# Altium schematic sheet Sheet2.SchDoc
size A4; SheetNumber: 1; SheetTotal: 1
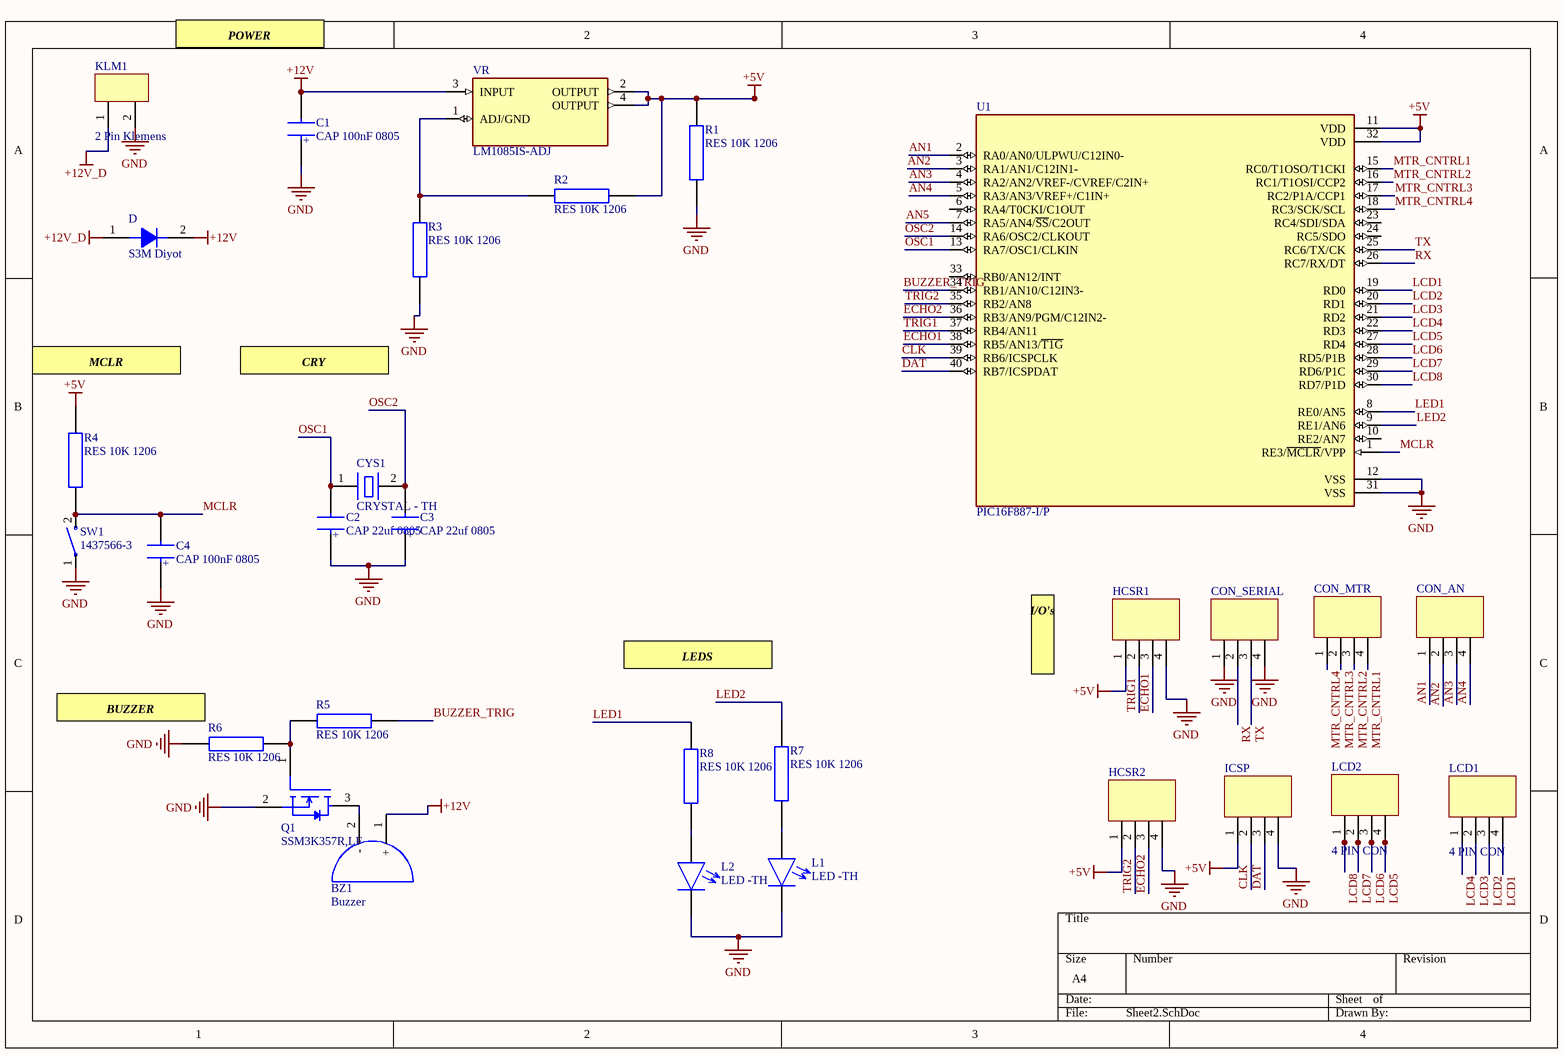
[diagram p0: Sheet2.SchDoc]

## Parts
BZ1  Buzzer  [CMI-9605IC]
C1  CAP 100nF 0805  [CAP_805]
C2  CAP 22uf 0805  [CAP_805]
C3  CAP 22uf 0805  [CAP_805]
C4  CAP 100nF 0805  [CAP_805]
CON_AN  4 PIN CON  [4 PIN 2.54MM]  (value not drawn)
CON_MTR  4 PIN CON  [4 PIN 2.54MM]  (value not drawn)
CON_SERIAL  4 PIN CON  [4 PIN 2.54MM]  (value not drawn)
CYS1  CRYSTAL - TH  [Kristal - HC-49Us -th]
D  S3M Diyot  [DO214AA]
HCSR1  4 PIN CON  [4 PIN 2.54MM]  (value not drawn)
HCSR2  4 PIN CON  [4 PIN 2.54MM]  (value not drawn)
ICSP  4 PIN CON  [4 PIN 2.54MM]  (value not drawn)
KLM1  2 Pin Klemens  [5.08mm-2 pin]
L1  LED -TH
L2  LED -TH
LCD1  4 PIN CON  [4 PIN 2.54MM]
LCD2  4 PIN CON  [4 PIN 2.54MM]
Q1  SSM3K357R,LF  [SOT-23F]
R1  RES 10K 1206  [RES_1206]
R2  RES 10K 1206  [RES_1206]
R3  RES 10K 1206  [RES_1206]
R4  RES 10K 1206  [RES_1206]
R5  RES 10K 1206  [RES_1206]
R6  RES 10K 1206  [RES_1206]
R7  RES 10K 1206  [RES_1206]
R8  RES 10K 1206  [RES_1206]
SW1  1437566-3  [SW_1437566-3]
U1  PIC16F887-I/P  [PIC_ZIF_SOCKET]
VR  LM1085IS-ADJ  [TO254P1524X483-4N]

## Nets
+5V: HCSR1.1 HCSR2.1 ICSP.1 R1.1 R2.1 R4.2 U1.11(VDD) U1.32(VDD) VR.2(OUTPUT) VR.4(OUTPUT)
+12V: BZ1.1(+) C1.2 D.2 VR.3(INPUT)
+12V_D: D.1 KLM1.1
GND: C1.1 C2.1 C3.1 C4.1 CON_SERIAL.1 CON_SERIAL.4 HCSR1.4 HCSR2.4 ICSP.4 KLM1.2 L1.2 L2.2 Q1.2(S) R1.2 R3.1 R6.2 SW1.1 U1.12(VSS) U1.31(VSS)
AN1: CON_AN.1 U1.2(RA0/AN0/ULPWU/C12IN0-)
AN2: CON_AN.2 U1.3(RA1/AN1/C12IN1-)
AN3: CON_AN.3 U1.4(RA2/AN2/VREF-/CVREF/C2IN+)
AN4: CON_AN.4 U1.5(RA3/AN3/VREF+/C1IN+)
AN5: U1.7(RA5/AN4/~{SS}/C2OUT)
BUZZER_TRIG: R5.1 U1.34(RB1/AN10/C12IN3-)
CLK: ICSP.2 U1.39(RB6/ICSPCLK)
DAT: ICSP.3 U1.40(RB7/ICSPDAT)
ECHO1: HCSR1.3 U1.38(RB5/AN13/~{T1G})
ECHO2: HCSR2.3 U1.36(RB3/AN9/PGM/C12IN2-)
LCD1: LCD1.4 U1.19(RD0)
LCD2: LCD1.3 U1.20(RD1)
LCD3: LCD1.2 U1.21(RD2)
LCD4: LCD1.1 U1.22(RD3)
LCD5: LCD2.4 U1.27(RD4)
LCD6: LCD2.3 U1.28(RD5/P1B)
LCD7: LCD2.2 U1.29(RD6/P1C)
LCD8: LCD2.1 U1.30(RD7/P1D)
LED1: R8.2 U1.8(RE0/AN5)
LED2: R7.2 U1.9(RE1/AN6)
MCLR: C4.2 R4.1 SW1.2 U1.1(RE3/~{MCLR}/VPP)
MTR_CNTRL1: CON_MTR.4 U1.15(RC0/T1OSO/T1CKI)
MTR_CNTRL2: CON_MTR.3 U1.16(RC1/T1OSI/CCP2)
MTR_CNTRL3: CON_MTR.2 U1.17(RC2/P1A/CCP1)
MTR_CNTRL4: CON_MTR.1 U1.18(RC3/SCK/SCL)
OSC1: C2.2 CYS1.1 U1.13(RA7/OSC1/CLKIN)
OSC2: C3.2 CYS1.2 U1.14(RA6/OSC2/CLKOUT)
RX: CON_SERIAL.2 U1.26(RC7/RX/DT)
TRIG1: HCSR1.2 U1.37(RB4/AN11)
TRIG2: HCSR2.2 U1.35(RB2/AN8)
TX: CON_SERIAL.3 U1.25(RC6/TX/CK)
NetBZ1_2: BZ1.2(-) Q1.3(D)
NetL1_1: L1.1 R7.1
NetL2_1: L2.1 R8.1
NetQ1_1: Q1.1(G) R5.2 R6.1
NetR2_2: R2.2 R3.2 VR.1(ADJ/GND)

Not connected (* = marked no-connect by the designer): U1 6(RA4/T0CKI/C1OUT) 10(RE2/AN7) 23(RC4/SDI/SDA) 24(RC5/SDO) 33(RB0/AN12/INT)

## Notes on the sheet
- POWER
- MCLR
- CRY
- LEDS
- I/O's
- (near R6) BUZZER
- (in symbol CAP 22uf 0805) +
- (in symbol CAP 100nF 0805) +

## Library data of the parts
BZ1 = BUZZER: Designed by: Ahmet Azboy
C1 C4 = CAP 100nF 0805: 0805 smd
C2 C3 = CAP 22uf 0805: 0805 smd
CON_AN CON_MTR CON_SERIAL HCSR1 HCSR2 ICSP LCD1 LCD2 = 4 PIN CON: 2.54mm vertical connector
CYS1 = CRYSTAL - TH: Smd tipi kristal
D = S3M Diyot: Current: 3A; Voltage: 1000V; Case/Package: DO214AA
KLM1 = 2 Pin Klemens: 5.08mm 2 pin klemens
Q1 = SSM3K357R,LF: Trans MOSFET N-CH Si 60V 0.65A Automotive 3-Pin SOT-23F T/R; Manufacturer: Toshiba; Designed by: Ahmet Azboy; Supplier 1: Mouser; Manufacturer Part Number: SSM3K357R,LF; RoHS: No; Pricing 1: 1=0,41000, 10=0,33600, 50=0,33600, 100=0,22900, 1000=0,12900, 10000=0,10300 (USD); ComponentLink1URL: https://toshiba.semicon-storage.com/info/docget.jsp?did=59207&prodName=SSM3K357R&src-supplier=Digi-Key; ComponentLink1Description: https://toshiba.semicon-storage.com/info/docget.jsp?did=59207&prodName=SSM3K357R&src-supplier=Digi-Key; Supplier Part Number 1: 757-SSM3K357RLF; Case/Package: SOT23F
SW1 = 1437566-3: Switch Tactile OFF (ON) SPST Rectangular Button Gull Wing 0.05A 12VDC SMD Loose Piece; Price: None; Value: *; Package: None; Availability: Unavailable; MP: 1437566-3
U1 = PIC16F887-I/P: MCU, 8-Bit, 14KB Flash, 368 RAM, 36 I/O, PDIP-40, PIC 16F Series | Microchip Technology Inc. PIC16F887-I/P; SnapEDA_Link: https://www.snapeda.com/parts/PIC16F887-I/P/Microchip/view-part/?ref=snap; Package: PDIP-40 Microchip; Value: *; MF: Microchip; MP: PIC16F887-I/P; Check_prices: https://www.snapeda.com/parts/PIC16F887-I/P/Microchip/view-part/?ref=eda
VR = LM1085IS-ADJ: 3-A, 29-V, linear voltage regulator 3-DDPAK/TO-263; MF: Texas Instruments; SnapEDA_Link: https://www.snapeda.com/parts/LM1085IS-ADJ/Texas%20Instruments/view-part/213969/?ref=snap; Price: None; MP: LM1085IS-ADJ; Availability: Unavailable; Mouser-Purchase-URL: https://snapeda.com/shop?store=Mouser&id=213969; Value: *; Arrow_Electronics-Purchase-URL: https://snapeda.com/shop?store=Arrow+Electronics&id=213969; DigiKey-Purchase-URL: https://snapeda.com/shop?store=DigiKey&id=213969; Package: TO-263-3 Texas Instruments